# Altium project Carte_Mere.PrjPcb (part 1 of 3)
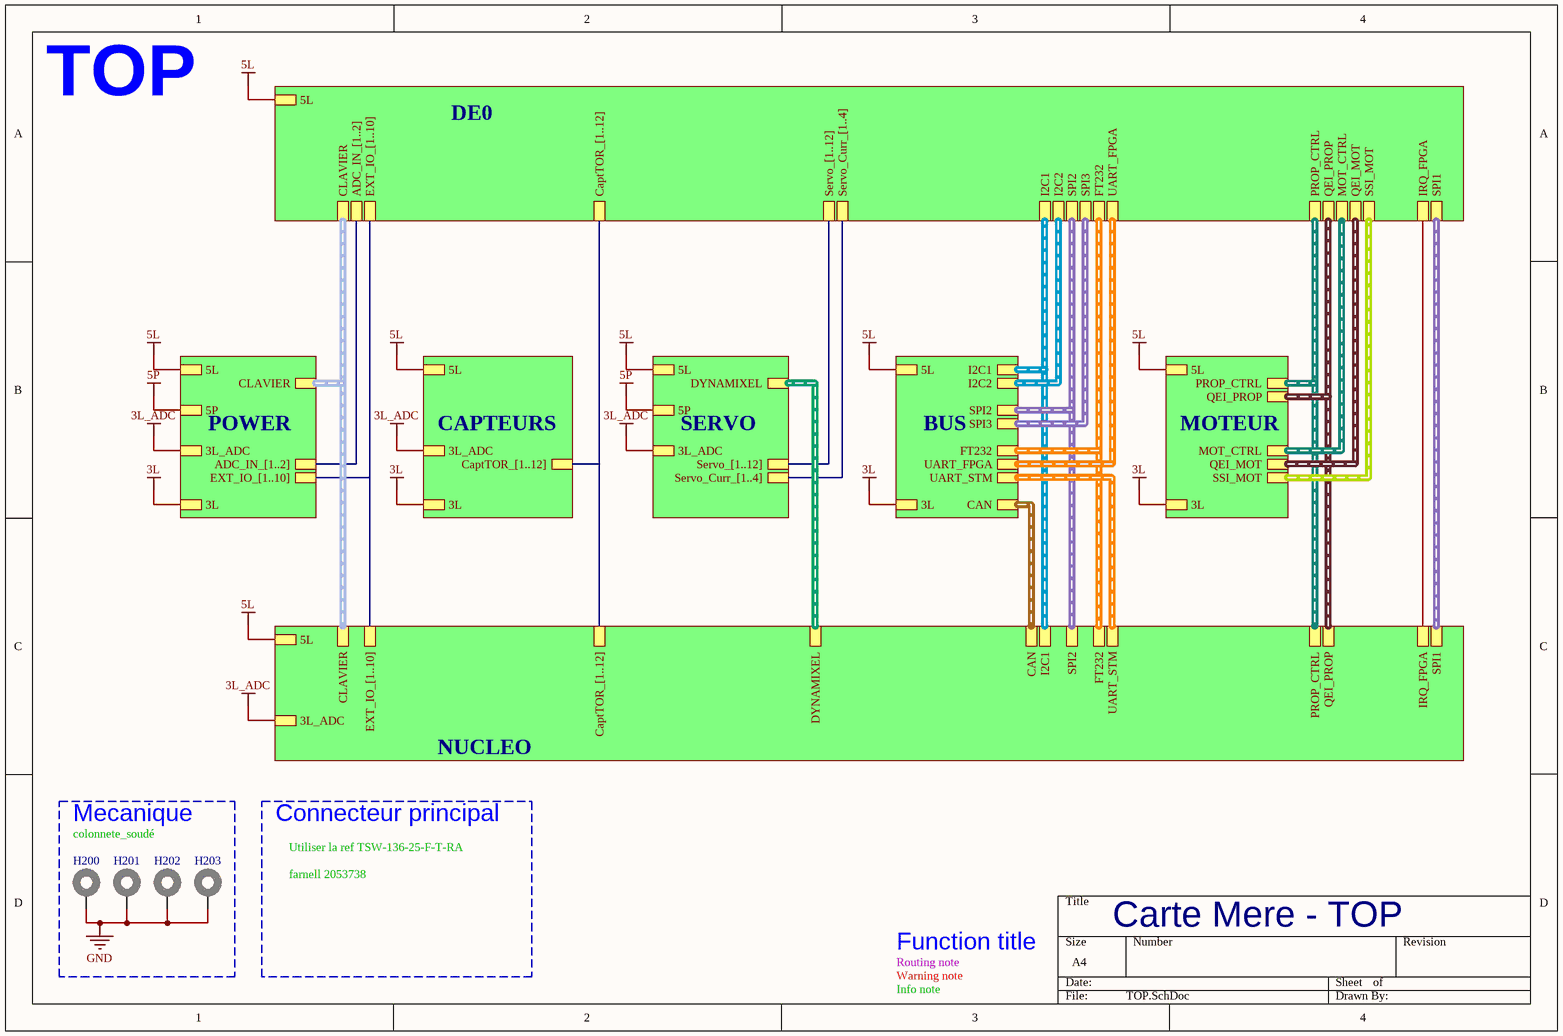
[diagram p0: TOP.SchDoc]
8 sheets, 396 parts. Net scope: hierarchical (ports join the sheet entries above them; power ports are global).
Board file: Carte_Mere.PcbDoc
Sheets:
  TOP.SchDoc
    DE0 = DE0_Nano.SchDoc
    NUCLEO = Nucleo.SchDoc
    CAPTEURS = Capteur.SchDoc
    BUS = Interface_BUS.SchDoc
    MOTEUR = Motorisation.SchDoc
    POWER = Power.SchDoc
    SERVO = Servomoteur.SchDoc

## Sheet TOP.SchDoc
size A4; Author: Audran; CompanyName: Goldorak; Address1: Electrolab; Address2: 52 rue Paul Lescop; Address3: 92000 Nanterre; DocumentNumber: 1; SheetNumber: 1; SheetTotal: 8; ProjectName: Cartes_2017

### Parts
H200  9774100960  [9774100960]  (value not drawn)
H201  9774100960  [9774100960]  (value not drawn)
H202  9774100960  [9774100960]  (value not drawn)
H203  9774100960  [9774100960]  (value not drawn)

### Sub-sheets
BUS = Interface_BUS.SchDoc: SPI2 (harness SPI2), SPI3 (harness SPI3), FT232 (harness FT232), I2C1 (harness I2C1), I2C2 (harness I2C2), 5L, UART_FPGA (harness UART_FPGA), UART_STM (harness UART_STM), CAN (harness CAN), 3L
CAPTEURS = Capteur.SchDoc: 3L_ADC, 5L, CaptTOR_[1..12], 3L
DE0 = DE0_Nano.SchDoc: FT232 (harness FT232), Servo_Curr_[1..4] (harness CLAVIER), UART_FPGA (harness UART_FPGA), CaptTOR_[1..12], SSI_MOT (harness SSI_MOT), I2C2 (harness I2C2), SPI1 (harness SPI1), IRQ_FPGA, CLAVIER (harness CLAVIER), I2C1 (harness I2C1), 5L, Servo_[1..12], SPI3 (harness SPI3), SPI2 (harness SPI2), QEI_MOT (harness QEI_MOT), MOT_CTRL (harness MOT_CTRL), QEI_PROP (harness QEI_PROP), PROP_CTRL (harness PROP_CTRL), ADC_IN_[1..2], EXT_IO_[1..10]
MOTEUR = Motorisation.SchDoc: QEI_PROP (harness QEI_PROP), QEI_MOT (harness QEI_MOT), MOT_CTRL (harness MOT_CTRL), 3L, PROP_CTRL (harness PROP_CTRL), SSI_MOT (harness SSI_MOT), 5L
NUCLEO = Nucleo.SchDoc: SPI1 (harness SPI1), UART_STM (harness UART_STM), I2C1 (harness I2C1), DYNAMIXEL (harness DYNAMIXEL), CaptTOR_[1..12], CAN (harness CAN), FT232 (harness FT232), SPI2 (harness SPI2), IRQ_FPGA, 3L_ADC, 5L, QEI_PROP (harness QEI_PROP), PROP_CTRL (harness PROP_CTRL), CLAVIER (harness CLAVIER), EXT_IO_[1..10]
POWER = Power.SchDoc: CLAVIER (harness CLAVIER), 3L, 3L_ADC, 5P, 5L, EXT_IO_[1..10], ADC_IN_[1..2]
SERVO = Servomoteur.SchDoc: 5L, DYNAMIXEL (harness DYNAMIXEL), 5P, 3L_ADC, Servo_[1..12], Servo_Curr_[1..4]

### Nets
3L: sheet CAPTEURS/3L, sheet BUS/3L, sheet MOTEUR/3L, sheet POWER/3L
3L_ADC: sheet NUCLEO/3L_ADC, sheet CAPTEURS/3L_ADC, sheet POWER/3L_ADC, sheet SERVO/3L_ADC
5L: sheet DE0/5L, sheet NUCLEO/5L, sheet CAPTEURS/5L, sheet BUS/5L, sheet MOTEUR/5L, sheet POWER/5L, sheet SERVO/5L
5P: sheet POWER/5P, sheet SERVO/5P
GND: H200.1 H201.1 H202.1 H203.1
IRQ_FPGA: sheet DE0/IRQ_FPGA, sheet NUCLEO/IRQ_FPGA

### Buses and harness runs
bus sheet CAPTEURS/CaptTOR_[1..12] = sheet DE0/CaptTOR_[1..12] = sheet NUCLEO/CaptTOR_[1..12]
bus sheet DE0/ADC_IN_[1..2] = sheet POWER/ADC_IN_[1..2]
bus sheet DE0/EXT_IO_[1..10] = sheet NUCLEO/EXT_IO_[1..10] = sheet POWER/EXT_IO_[1..10]
bus sheet DE0/Servo_[1..12] = sheet SERVO/Servo_[1..12]
harness sheet BUS/CAN = sheet NUCLEO/CAN
harness sheet BUS/FT232 = sheet DE0/FT232 = sheet NUCLEO/FT232
harness sheet BUS/I2C1 = sheet DE0/I2C1 = sheet NUCLEO/I2C1
harness sheet BUS/I2C2 = sheet DE0/I2C2
harness sheet BUS/SPI2 = sheet DE0/SPI2 = sheet NUCLEO/SPI2
harness sheet BUS/SPI3 = sheet DE0/SPI3
harness sheet BUS/UART_FPGA = sheet DE0/UART_FPGA
harness sheet BUS/UART_STM = sheet NUCLEO/UART_STM
harness sheet DE0/CLAVIER = sheet NUCLEO/CLAVIER = sheet POWER/CLAVIER
harness sheet DE0/MOT_CTRL = sheet MOTEUR/MOT_CTRL
harness sheet DE0/PROP_CTRL = sheet MOTEUR/PROP_CTRL = sheet NUCLEO/PROP_CTRL
harness sheet DE0/QEI_MOT = sheet MOTEUR/QEI_MOT
harness sheet DE0/QEI_PROP = sheet MOTEUR/QEI_PROP = sheet NUCLEO/QEI_PROP
harness sheet DE0/SPI1 = sheet NUCLEO/SPI1
harness sheet DE0/SSI_MOT = sheet MOTEUR/SSI_MOT
harness sheet NUCLEO/DYNAMIXEL = sheet SERVO/DYNAMIXEL

### Notes on the sheet
- TOP
- Mecanique
- colonnete_soudé
- Connecteur principal
- Utiliser la ref TSW-136-25-F-T-RA
- farnell 2053738
- Routing note
- Warning note
- Function title
- Carte Mere - TOP
- Info note

### Library data of the parts
H200-H203 = 9774100960: WA-SMST SMT Steel Spacer with through hole, OD6mm, ID3.3xL10mm; Manufacturer: Wurth Elektronik; Value: 3.3x10; ComponentLink1Description: Manufacturer; ComponentLink1URL: https://www.we-online.com/catalog/en/SMST_SMD_STEEL_SPACER_3_3_INTERNAL_NON_STOP/#9774100960; ComponentLink2Description: Datasheet; ComponentLink2URL: https://www.we-online.com/catalog/datasheet/9774100960.pdf; Manufacturer Part Number: 9774100960; Supplier 1: Farnell; Supplier Part Number 1: 2497637

## Sheet DE0_Nano.SchDoc
size A4; Author: Audran; CompanyName: Goldorak; Address1: Electrolab; Address2: 52 rue Paul Lescop; Address3: 92000 Nanterre; DocumentNumber: 3; SheetNumber: 3; SheetTotal: 8; ProjectName: Cartes_2017
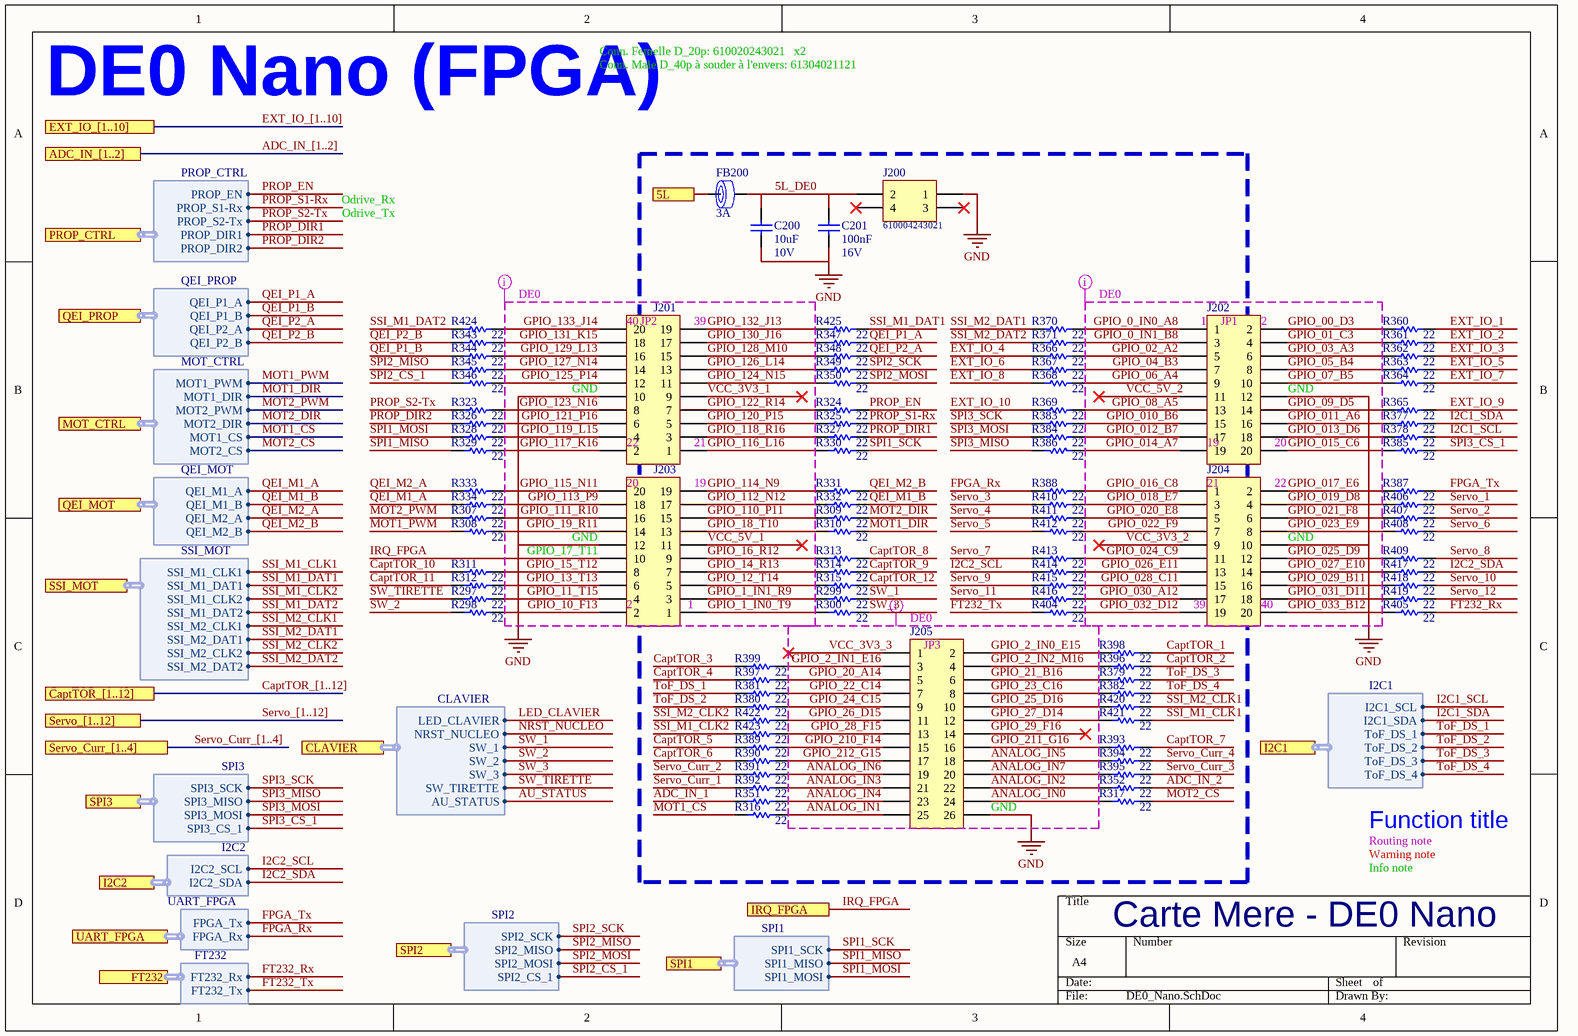
[diagram p1: DE0_Nano.SchDoc]

### Parts
C200  10uF  RatedVoltage: 10V  [WCAP-CSGP_0805, 2x1.25x1.25]
C201  100nF  RatedVoltage: 16V  [WCAP-CSGP_0402, 1x0.5x0.5]
FB200  RatedCurrent: 3A  [WE-CBF_0805_High Current]  (hidden comment: 742792023)
J200  610004243021  [610004243021_NO-HOLE]
J201  610020243021  [610020243021_NO-HOLE]  (value not drawn)
J202  610020243021  [610020243021_NO-HOLE]  (value not drawn)
J203  610020243021  [610020243021_NO-HOLE]  (value not drawn)
J204  610020243021  [610020243021_NO-HOLE]  (value not drawn)
J205  610026243021  [610026243021_NO-HOLE]  (value not drawn)
R297  value 22  [RESC1005X04N]  (hidden comment: RC0402FR-0722RL)
R298  value 22  [RESC1005X04N]  (hidden comment: RC0402FR-0722RL)
R299  value 22  [RESC1005X04N]  (hidden comment: RC0402FR-0722RL)
R300  value 22  [RESC1005X04N]  (hidden comment: RC0402FR-0722RL)
R307  value 22  [RESC1005X04N]  (hidden comment: RC0402FR-0722RL)
R308  value 22  [RESC1005X04N]  (hidden comment: RC0402FR-0722RL)
R309  value 22  [RESC1005X04N]  (hidden comment: RC0402FR-0722RL)
R310  value 22  [RESC1005X04N]  (hidden comment: RC0402FR-0722RL)
R311  value 22  [RESC1005X04N]  (hidden comment: RC0402FR-0722RL)
R312  value 22  [RESC1005X04N]  (hidden comment: RC0402FR-0722RL)
R313  value 22  [RESC1005X04N]  (hidden comment: RC0402FR-0722RL)
R314  value 22  [RESC1005X04N]  (hidden comment: RC0402FR-0722RL)
R315  value 22  [RESC1005X04N]  (hidden comment: RC0402FR-0722RL)
R316  value 22  [RESC1005X04N]  (hidden comment: RC0402FR-0722RL)
R317  value 22  [RESC1005X04N]  (hidden comment: RC0402FR-0722RL)
R323  value 22  [RESC1005X04N]  (hidden comment: RC0402FR-0722RL)
R324  value 22  [RESC1005X04N]  (hidden comment: RC0402FR-0722RL)
R325  value 22  [RESC1005X04N]  (hidden comment: RC0402FR-0722RL)
R326  value 22  [RESC1005X04N]  (hidden comment: RC0402FR-0722RL)
R327  value 22  [RESC1005X04N]  (hidden comment: RC0402FR-0722RL)
R328  value 22  [RESC1005X04N]  (hidden comment: RC0402FR-0722RL)
R329  value 22  [RESC1005X04N]  (hidden comment: RC0402FR-0722RL)
R330  value 22  [RESC1005X04N]  (hidden comment: RC0402FR-0722RL)
R331  value 22  [RESC1005X04N]  (hidden comment: RC0402FR-0722RL)
R332  value 22  [RESC1005X04N]  (hidden comment: RC0402FR-0722RL)
R333  value 22  [RESC1005X04N]  (hidden comment: RC0402FR-0722RL)
R334  value 22  [RESC1005X04N]  (hidden comment: RC0402FR-0722RL)
R343  value 22  [RESC1005X04N]  (hidden comment: RC0402FR-0722RL)
R344  value 22  [RESC1005X04N]  (hidden comment: RC0402FR-0722RL)
R345  value 22  [RESC1005X04N]  (hidden comment: RC0402FR-0722RL)
R346  value 22  [RESC1005X04N]  (hidden comment: RC0402FR-0722RL)
R347  value 22  [RESC1005X04N]  (hidden comment: RC0402FR-0722RL)
R348  value 22  [RESC1005X04N]  (hidden comment: RC0402FR-0722RL)
R349  value 22  [RESC1005X04N]  (hidden comment: RC0402FR-0722RL)
R350  value 22  [RESC1005X04N]  (hidden comment: RC0402FR-0722RL)
R351  value 22  [RESC1005X04N]  (hidden comment: RC0402FR-0722RL)
R352  value 22  [RESC1005X04N]  (hidden comment: RC0402FR-0722RL)
R360  value 22  [RESC1005X04N]  (hidden comment: RC0402FR-0722RL)
R361  value 22  [RESC1005X04N]  (hidden comment: RC0402FR-0722RL)
R362  value 22  [RESC1005X04N]  (hidden comment: RC0402FR-0722RL)
R363  value 22  [RESC1005X04N]  (hidden comment: RC0402FR-0722RL)
R364  value 22  [RESC1005X04N]  (hidden comment: RC0402FR-0722RL)
R365  value 22  [RESC1005X04N]  (hidden comment: RC0402FR-0722RL)
R366  value 22  [RESC1005X04N]  (hidden comment: RC0402FR-0722RL)
R367  value 22  [RESC1005X04N]  (hidden comment: RC0402FR-0722RL)
R368  value 22  [RESC1005X04N]  (hidden comment: RC0402FR-0722RL)
R369  value 22  [RESC1005X04N]  (hidden comment: RC0402FR-0722RL)
R370  value 22  [RESC1005X04N]  (hidden comment: RC0402FR-0722RL)
R371  value 22  [RESC1005X04N]  (hidden comment: RC0402FR-0722RL)
R377  value 22  [RESC1005X04N]  (hidden comment: RC0402FR-0722RL)
R378  value 22  [RESC1005X04N]  (hidden comment: RC0402FR-0722RL)
R379  value 22  [RESC1005X04N]  (hidden comment: RC0402FR-0722RL)
R380  value 22  [RESC1005X04N]  (hidden comment: RC0402FR-0722RL)
R381  value 22  [RESC1005X04N]  (hidden comment: RC0402FR-0722RL)
R382  value 22  [RESC1005X04N]  (hidden comment: RC0402FR-0722RL)
R383  value 22  [RESC1005X04N]  (hidden comment: RC0402FR-0722RL)
R384  value 22  [RESC1005X04N]  (hidden comment: RC0402FR-0722RL)
R385  value 22  [RESC1005X04N]  (hidden comment: RC0402FR-0722RL)
R386  value 22  [RESC1005X04N]  (hidden comment: RC0402FR-0722RL)
R387  value 22  [RESC1005X04N]  (hidden comment: RC0402FR-0722RL)
R388  value 22  [RESC1005X04N]  (hidden comment: RC0402FR-0722RL)
R389  value 22  [RESC1005X04N]  (hidden comment: RC0402FR-0722RL)
R390  value 22  [RESC1005X04N]  (hidden comment: RC0402FR-0722RL)
R391  value 22  [RESC1005X04N]  (hidden comment: RC0402FR-0722RL)
R392  value 22  [RESC1005X04N]  (hidden comment: RC0402FR-0722RL)
R393  value 22  [RESC1005X04N]  (hidden comment: RC0402FR-0722RL)
R394  value 22  [RESC1005X04N]  (hidden comment: RC0402FR-0722RL)
R395  value 22  [RESC1005X04N]  (hidden comment: RC0402FR-0722RL)
R396  value 22  [RESC1005X04N]  (hidden comment: RC0402FR-0722RL)
R397  value 22  [RESC1005X04N]  (hidden comment: RC0402FR-0722RL)
R398  value 22  [RESC1005X04N]  (hidden comment: RC0402FR-0722RL)
R399  value 22  [RESC1005X04N]  (hidden comment: RC0402FR-0722RL)
R404  value 22  [RESC1005X04N]  (hidden comment: RC0402FR-0722RL)
R405  value 22  [RESC1005X04N]  (hidden comment: RC0402FR-0722RL)
R406  value 22  [RESC1005X04N]  (hidden comment: RC0402FR-0722RL)
R407  value 22  [RESC1005X04N]  (hidden comment: RC0402FR-0722RL)
R408  value 22  [RESC1005X04N]  (hidden comment: RC0402FR-0722RL)
R409  value 22  [RESC1005X04N]  (hidden comment: RC0402FR-0722RL)
R410  value 22  [RESC1005X04N]  (hidden comment: RC0402FR-0722RL)
R411  value 22  [RESC1005X04N]  (hidden comment: RC0402FR-0722RL)
R412  value 22  [RESC1005X04N]  (hidden comment: RC0402FR-0722RL)
R413  value 22  [RESC1005X04N]  (hidden comment: RC0402FR-0722RL)
R414  value 22  [RESC1005X04N]  (hidden comment: RC0402FR-0722RL)
R415  value 22  [RESC1005X04N]  (hidden comment: RC0402FR-0722RL)
R416  value 22  [RESC1005X04N]  (hidden comment: RC0402FR-0722RL)
R417  value 22  [RESC1005X04N]  (hidden comment: RC0402FR-0722RL)
R418  value 22  [RESC1005X04N]  (hidden comment: RC0402FR-0722RL)
R419  value 22  [RESC1005X04N]  (hidden comment: RC0402FR-0722RL)
R420  value 22  [RESC1005X04N]  (hidden comment: RC0402FR-0722RL)
R421  value 22  [RESC1005X04N]  (hidden comment: RC0402FR-0722RL)
R422  value 22  [RESC1005X04N]  (hidden comment: RC0402FR-0722RL)
R423  value 22  [RESC1005X04N]  (hidden comment: RC0402FR-0722RL)
R424  value 22  [RESC1005X04N]  (hidden comment: RC0402FR-0722RL)
R425  value 22  [RESC1005X04N]  (hidden comment: RC0402FR-0722RL)

### Ports
5L, ADC_IN_[1..2], CaptTOR_[1..12], CLAVIER (harness CLAVIER), EXT_IO_[1..10], FT232 (harness FT232), I2C1 (harness I2C1), I2C2 (harness I2C2), IRQ_FPGA, MOT_CTRL (harness MOT_CTRL), PROP_CTRL (harness PROP_CTRL), QEI_MOT (harness QEI_MOT), QEI_PROP (harness QEI_PROP), Servo_[1..12], Servo_Curr_[1..4] (harness CLAVIER), SPI1 (harness SPI1), SPI2 (harness SPI2), SPI3 (harness SPI3), SSI_MOT (harness SSI_MOT), UART_FPGA (harness UART_FPGA)

### Harnesses
PROP_CTRL: PROP_EN, PROP_S1-Rx, PROP_S2-Tx, PROP_DIR1, PROP_DIR2
QEI_PROP: QEI_P1_A, QEI_P1_B, QEI_P2_A, QEI_P2_B
MOT_CTRL: MOT1_PWM, MOT1_DIR, MOT2_PWM, MOT2_DIR, MOT1_CS, MOT2_CS
QEI_MOT: QEI_M1_A, QEI_M1_B, QEI_M2_A, QEI_M2_B
SSI_MOT: SSI_M1_CLK1, SSI_M1_DAT1, SSI_M1_CLK2, SSI_M1_DAT2, SSI_M2_CLK1, SSI_M2_DAT1, SSI_M2_CLK2, SSI_M2_DAT2
SPI3: SPI3_SCK, SPI3_MISO, SPI3_MOSI, SPI3_CS_1
I2C2: I2C2_SCL, I2C2_SDA
UART_FPGA: FPGA_Tx, FPGA_Rx
FT232: FT232_Tx, FT232_Rx
SPI2: SPI2_SCK, SPI2_MISO, SPI2_MOSI, SPI2_CS_1
SPI1: SPI1_SCK, SPI1_MISO, SPI1_MOSI
I2C1: I2C1_SCL, I2C1_SDA, ToF_DS_1, ToF_DS_2, ToF_DS_3, ToF_DS_4
CLAVIER: LED_CLAVIER, NRST_NUCLEO, SW_1, SW_2, SW_3, SW_TIRETTE, AU_STATUS

### Nets
5L: FB200.1 ; port 5L
GND: C200.2 C201.2 J200.1 J201.10 J202.12 J203.12 J204.10 J205.26
5L_DE0: C200.1 C201.1 FB200.2 J200.2
ADC_IN_1: R351.1
ADC_IN_2: R352.2
ANALOG_IN0: J205.24 R317.1
ANALOG_IN1: J205.25 R316.2
ANALOG_IN2: J205.22 R352.1
ANALOG_IN3: J205.21 R392.2
ANALOG_IN4: J205.23 R351.2
ANALOG_IN5: J205.18 R394.1
ANALOG_IN6: J205.19 R391.2
ANALOG_IN7: J205.20 R395.1
CaptTOR_1: R398.2
CaptTOR_2: R396.1
CaptTOR_3: R399.2
CaptTOR_4: R397.1
CaptTOR_5: R389.1
CaptTOR_6: R390.1
CaptTOR_7: R393.2
CaptTOR_8: R313.2
CaptTOR_9: R314.2
CaptTOR_10: R311.1
CaptTOR_11: R312.1
CaptTOR_12: R315.2
EXT_IO_1: R360.2
EXT_IO_2: R361.2
EXT_IO_3: R362.2
EXT_IO_4: R366.1
EXT_IO_5: R363.2
EXT_IO_6: R367.1
EXT_IO_7: R364.2
EXT_IO_8: R368.1
EXT_IO_9: R365.2
EXT_IO_10: R369.1
FPGA_Rx: R388.1 ; port UART_FPGA.FPGA_Rx
FPGA_Tx: R387.2 ; port UART_FPGA.FPGA_Tx
FT232_Rx: R405.2 ; port FT232.FT232_Rx
FT232_Tx: R404.1 ; port FT232.FT232_Tx
GPIO_00_D3: J202.2 R360.1
GPIO_0_IN0_A8: J202.1 R370.2
GPIO_0_IN1_B8: J202.3 R371.2
GPIO_01_C3: J202.4 R361.1
GPIO_1_IN0_T9: J203.1 R300.1
GPIO_1_IN1_R9: J203.3 R299.1
GPIO_02_A2: J202.5 R366.2
GPIO_2_IN0_E15: J205.2 R398.1
GPIO_2_IN1_E16: J205.3 R399.1
GPIO_2_IN2_M16: J205.4 R396.2
GPIO_03_A3: J202.6 R362.1
GPIO_04_B3: J202.7 R367.2
GPIO_05_B4: J202.8 R363.1
GPIO_06_A4: J202.9 R368.2
GPIO_07_B5: J202.10 R364.1
GPIO_08_A5: J202.13 R369.2
GPIO_09_D5: J202.14 R365.1
GPIO_010_B6: J202.15 R383.2
GPIO_10_F13: J203.2 R298.2
GPIO_011_A6: J202.16 R377.1
GPIO_11_T15: J203.4 R297.2
GPIO_012_B7: J202.17 R384.2
GPIO_12_T14: J203.5 R315.1
GPIO_013_D6: J202.18 R378.1
GPIO_13_T13: J203.6 R312.2
GPIO_014_A7: J202.19 R386.1
GPIO_14_R13: J203.7 R314.1
GPIO_015_C6: J202.20 R385.1
GPIO_15_T12: J203.8 R311.2
GPIO_016_C8: J204.1 R388.2
GPIO_16_R12: J203.9 R313.1
GPIO_017_E6: J204.2 R387.1
GPIO_018_E7: J204.3 R410.2
GPIO_18_T10: J203.13 R310.1
GPIO_019_D8: J204.4 R406.1
GPIO_19_R11: J203.14 R308.2
GPIO_20_A14: J205.5 R397.2
GPIO_020_E8: J204.5 R411.2
GPIO_21_B16: J205.6 R379.1
GPIO_021_F8: J204.6 R407.1
GPIO_22_C14: J205.7 R381.2
GPIO_022_F9: J204.7 R412.2
GPIO_23_C16: J205.8 R382.2
GPIO_023_E9: J204.8 R408.1
GPIO_024_C9: J204.11 R413.2
GPIO_24_C15: J205.9 R380.2
GPIO_025_D9: J204.12 R409.1
GPIO_25_D16: J205.10 R420.1
GPIO_26_D15: J205.11 R422.2
GPIO_026_E11: J204.13 R414.2
GPIO_27_D14: J205.12 R421.1
GPIO_027_E10: J204.14 R417.1
GPIO_028_C11: J204.15 R415.2
GPIO_28_F15: J205.13 R423.2
GPIO_029_B11: J204.16 R418.1
GPIO_29_F16: J205.14
GPIO_030_A12: J204.17 R416.2
GPIO_031_D11: J204.18 R419.1
GPIO_032_D12: J204.19 R404.2
GPIO_033_B12: J204.20 R405.1
GPIO_110_P11: J203.15 R309.1
GPIO_111_R10: J203.16 R307.2
GPIO_112_N12: J203.17 R332.1
GPIO_113_P9: J203.18 R334.2
GPIO_114_N9: J203.19 R331.1
GPIO_115_N11: J203.20 R333.2
GPIO_116_L16: J201.1 R330.1
GPIO_117_K16: J201.2 R329.2
GPIO_118_R16: J201.3 R327.1
GPIO_119_L15: J201.4 R328.2
GPIO_120_P15: J201.5 R325.1
GPIO_121_P16: J201.6 R326.2
GPIO_122_R14: J201.7 R324.1
GPIO_123_N16: J201.8 R323.2
GPIO_124_N15: J201.11 R350.1
GPIO_125_P14: J201.12 R346.2
GPIO_126_L14: J201.13 R349.1
GPIO_127_N14: J201.14 R345.2
GPIO_128_M10: J201.15 R348.1
GPIO_129_L13: J201.16 R344.2
GPIO_130_J16: J201.17 R347.1
GPIO_131_K15: J201.18 R343.2
GPIO_132_J13: J201.19 R425.1
GPIO_133_J14: J201.20 R424.2
GPIO_210_F14: J205.15 R389.2
GPIO_211_G16: J205.16 R393.1
GPIO_212_G15: J205.17 R390.2
I2C1_SCL: R378.2 ; port I2C1.I2C1_SCL
I2C1_SDA: R377.2 ; port I2C1.I2C1_SDA
I2C2_SCL: R414.1 ; port I2C2.I2C2_SCL
I2C2_SDA: R417.2 ; port I2C2.I2C2_SDA
IRQ_FPGA: J203.10 ; port IRQ_FPGA
MOT1_CS: R316.1 ; port MOT_CTRL.MOT1_CS
MOT1_DIR: R310.2 ; port MOT_CTRL.MOT1_DIR
MOT1_PWM: R308.1 ; port MOT_CTRL.MOT1_PWM
MOT2_CS: R317.2 ; port MOT_CTRL.MOT2_CS
MOT2_DIR: R309.2 ; port MOT_CTRL.MOT2_DIR
MOT2_PWM: R307.1 ; port MOT_CTRL.MOT2_PWM
PROP_DIR1: R327.2 ; port PROP_CTRL.PROP_DIR1
PROP_DIR2: R326.1 ; port PROP_CTRL.PROP_DIR2
PROP_EN: R324.2 ; port PROP_CTRL.PROP_EN
PROP_S1-Rx: R325.2 ; port PROP_CTRL.PROP_S1-Rx
PROP_S2-Tx: R323.1 ; port PROP_CTRL.PROP_S2-Tx
QEI_M1_A: R334.1 ; port QEI_MOT.QEI_M1_A
QEI_M1_B: R332.2 ; port QEI_MOT.QEI_M1_B
QEI_M2_A: R333.1 ; port QEI_MOT.QEI_M2_A
QEI_M2_B: R331.2 ; port QEI_MOT.QEI_M2_B
QEI_P1_A: R347.2 ; port QEI_PROP.QEI_P1_A
QEI_P1_B: R344.1 ; port QEI_PROP.QEI_P1_B
QEI_P2_A: R348.2 ; port QEI_PROP.QEI_P2_A
QEI_P2_B: R343.1 ; port QEI_PROP.QEI_P2_B
Servo_1: R406.2
Servo_2: R407.2
Servo_3: R410.1
Servo_4: R411.1
Servo_5: R412.1
Servo_6: R408.2
Servo_7: R413.1
Servo_8: R409.2
Servo_9: R415.1
Servo_10: R418.2
Servo_11: R416.1
Servo_12: R419.2
Servo_Curr_1: R392.1
Servo_Curr_2: R391.1
Servo_Curr_3: R395.2
Servo_Curr_4: R394.2
SPI1_MISO: R329.1 ; port SPI1.SPI1_MISO
SPI1_MOSI: R328.1 ; port SPI1.SPI1_MOSI
SPI1_SCK: R330.2 ; port SPI1.SPI1_SCK
SPI2_CS_1: R346.1 ; port SPI2.SPI2_CS_1
SPI2_MISO: R345.1 ; port SPI2.SPI2_MISO
SPI2_MOSI: R350.2 ; port SPI2.SPI2_MOSI
SPI2_SCK: R349.2 ; port SPI2.SPI2_SCK
SPI3_CS_1: R385.2 ; port SPI3.SPI3_CS_1
SPI3_MISO: R386.2 ; port SPI3.SPI3_MISO
SPI3_MOSI: R384.1 ; port SPI3.SPI3_MOSI
SPI3_SCK: R383.1 ; port SPI3.SPI3_SCK
SSI_M1_CLK1: R421.2 ; port SSI_MOT.SSI_M1_CLK1
SSI_M1_CLK2: R423.1 ; port SSI_MOT.SSI_M1_CLK2
SSI_M1_DAT1: R425.2 ; port SSI_MOT.SSI_M1_DAT1
SSI_M1_DAT2: R424.1 ; port SSI_MOT.SSI_M1_DAT2
SSI_M2_CLK1: R420.2 ; port SSI_MOT.SSI_M2_CLK1
SSI_M2_CLK2: R422.1 ; port SSI_MOT.SSI_M2_CLK2
SSI_M2_DAT1: R370.1 ; port SSI_MOT.SSI_M2_DAT1
SSI_M2_DAT2: R371.1 ; port SSI_MOT.SSI_M2_DAT2
SW_1: R299.2 ; port CLAVIER.SW_1
SW_2: R298.1 ; port CLAVIER.SW_2
SW_3: R300.2 ; port CLAVIER.SW_3
SW_TIRETTE: R297.1 ; port CLAVIER.SW_TIRETTE
ToF_DS_1: R381.1 ; port I2C1.ToF_DS_1
ToF_DS_2: R380.1 ; port I2C1.ToF_DS_2
ToF_DS_3: R379.2 ; port I2C1.ToF_DS_3
ToF_DS_4: R382.1 ; port I2C1.ToF_DS_4
VCC_3V3_1: J201.9
VCC_3V3_2: J204.9
VCC_3V3_3: J205.1
VCC_5V_1: J203.11
VCC_5V_2: J202.11

Not connected (* = marked no-connect by the designer): J200 3* 4*

### Buses and harness runs
bus ADC_IN_[1..2] = port ADC_IN_[1..2]
bus CaptTOR_[1..12] = port CaptTOR_[1..12]
bus EXT_IO_[1..10] = port EXT_IO_[1..10]
bus Servo_[1..12] = port Servo_[1..12]
bus Servo_Curr_[1..4]

### Layout directives
net class DE0: ANALOG_IN0, ANALOG_IN1, ANALOG_IN2, ANALOG_IN3, ANALOG_IN4, ANALOG_IN5, ANALOG_IN6, ANALOG_IN7, GND, GPIO_00_D3, GPIO_0_IN0_A8, GPIO_0_IN1_B8, GPIO_01_C3, GPIO_1_IN0_T9, GPIO_1_IN1_R9, GPIO_02_A2, GPIO_2_IN0_E15, GPIO_2_IN1_E16, GPIO_2_IN2_M16, GPIO_03_A3, GPIO_04_B3, GPIO_05_B4, GPIO_06_A4, GPIO_07_B5, GPIO_08_A5, GPIO_09_D5, GPIO_010_B6, GPIO_10_F13, GPIO_011_A6, GPIO_11_T15, GPIO_012_B7, GPIO_12_T14, GPIO_013_D6, GPIO_13_T13, GPIO_014_A7, GPIO_14_R13, GPIO_015_C6, GPIO_15_T12, GPIO_016_C8, GPIO_16_R12, GPIO_017_E6, GPIO_018_E7, GPIO_18_T10, GPIO_019_D8, GPIO_19_R11, GPIO_20_A14, GPIO_020_E8, GPIO_21_B16, GPIO_021_F8, GPIO_22_C14, GPIO_022_F9, GPIO_23_C16, GPIO_023_E9, GPIO_024_C9, GPIO_24_C15, GPIO_025_D9, GPIO_25_D16, GPIO_26_D15, GPIO_026_E11, GPIO_27_D14, GPIO_027_E10, GPIO_028_C11, GPIO_28_F15, GPIO_029_B11, GPIO_29_F16, GPIO_030_A12, GPIO_031_D11, GPIO_032_D12, GPIO_033_B12, GPIO_110_P11, GPIO_111_R10, GPIO_112_N12, GPIO_113_P9, GPIO_114_N9, GPIO_115_N11, GPIO_116_L16, GPIO_117_K16, GPIO_118_R16, GPIO_119_L15, GPIO_120_P15, GPIO_121_P16, GPIO_122_R14, GPIO_123_N16, GPIO_124_N15, GPIO_125_P14, GPIO_126_L14, GPIO_127_N14, GPIO_128_M10, GPIO_129_L13, GPIO_130_J16, GPIO_131_K15, GPIO_132_J13, GPIO_133_J14, GPIO_210_F14, GPIO_211_G16, GPIO_212_G15, VCC_3V3_1, VCC_3V3_2, VCC_3V3_3, VCC_5V_1, VCC_5V_2

### Notes on the sheet
- DE0 Nano (FPGA)
- Conn. Male D_40p à souder à l'envers: 61304021121
- Conn. Femelle D_20p: 610020243021   x2
- Odrive_Tx
- Odrive_Rx
- (near J201) 40
- (near J201) JP2
- (near J201) 39
- (near J202) 1
- (near J202) JP1
- (near J202) 2
- (near J201) GND
- (near J201) 22
- (near J201) 21
- (near J202) 19
- (near J202) 20
- (near J202) GND
- (near J203) 20
- (near J203) 19
- (near J204) 21
- (near J204) 22
- (near J203) GND
- GPIO_17_T11
- (near J204) GND
- (near J203) 2
- (near J203) 1
- (near J205) JP3
- (near J204) 39
- (near J204) 40
- (near J205) GND
- Routing note
- Function title
- Warning note
- Info note
- Carte Mere - DE0 Nano

### Library data of the parts
C200 = WCAP-CSGP, 885012207026: CAP CER 10uF 10V X7R 0805; Manufacturer: Wurth Elektronik; ComponentLink1Description: Datasheet; ComponentLink1URL: http://katalog.we-online.com/pbs/datasheet/885012207026.pdf; Manufacturer Part Number: 885012207026; Value: 10uF; Size: 0805; CeramicType: X7R; Supplier 1: Farnell; Supplier Part Number 1: 2495189; Supplier Part Number 2: C15850; Supplier 2: JLCPCB; Supplier Footprint 2: 0805
C201 = WCAP-CSGP, 885012205037: CAP CER 100nF 16V X7R 0402; Manufacturer: Wurth Elektronik; ComponentLink1Description: Datasheet; ComponentLink1URL: http://katalog.we-online.com/pbs/datasheet/885012205037.pdf; Manufacturer Part Number: 885012205037; Value: 100nF; Size: 0402; CeramicType: X7R; Supplier 2: JLCPCB; Supplier Part Number 2: C1525; Supplier Footprint 2: 0402
FB200 = WE-CBF, 742792023: Ferrite Bead 120ohm 0805 3A; Manufacturer: Wurth Elektronik; Value: 120; ComponentLink1Description: Manufacturer; ComponentLink1URL: https://www.we-online.com/catalog/en/WE-CBF/?sq=742792023#742792023; ComponentLink2Description: Datasheet; ComponentLink2URL: https://www.we-online.com/catalog/datasheet/742792023.pdf; Manufacturer Part Number: 742792023; Supplier 2: JLCPCB; Supplier Part Number 2: C1015; Supplier 1: Farnell; Supplier Part Number 1: 1635732; Supplier Footprint 2: 0805
J200 = 610004243021: WR-PHD Socket Header, SMT, pitch 2.54mm, Dual Row, Vertical, 4p; Manufacturer: Wurth Elektronik; Value: 4; ComponentLink1Description: Datasheet; ComponentLink1URL: https://www.we-online.com/catalog/datasheet/610004243021.pdf; Manufacturer Part Number: 610004243021; Supplier 1: Farnell; Supplier Part Number 1: 2827931
J201-J204 = 610020243021: WR-PHD Socket Header, SMT, pitch 2.54mm, Dual Row, Vertical, 20p; Manufacturer: Wurth Elektronik; Value: 20; ComponentLink1Description: Datasheet; ComponentLink1URL: https://www.we-online.com/catalog/datasheet/610020243021.pdf; Manufacturer Part Number: 610020243021; Supplier 1: Farnell; Supplier Part Number 1: 2827937
J205 = 610026243021: WR-PHD Socket Header, SMT, pitch 2.54mm, Dual Row, Vertical, 26p; Manufacturer: Wurth Elektronik; Value: 26; ComponentLink1Description: Datasheet; ComponentLink1URL: https://www.we-online.com/catalog/datasheet/610026243021.pdf; Manufacturer Part Number: 610026243021; Supplier 1: Farnell; Supplier Part Number 1: 2827940
R297-R300 R307-R317 R323-R334 R343-R352 R360-R371 R377-R399 R404-R425 = RC0402FR-0722RL: RES SMD 22 OHM 1% 1/16W 0402; Manufacturer: Yageo; Power: 63mW; Vmax: 50V; Type: Thick Film; ComponentLink1Description: Manufacturer; ComponentLink1URL: http://www.yageo.com/NewPortal/_en/index.jsp; ComponentLink2Description: Datasheet; ComponentLink2URL: http://www.farnell.com/datasheets/2167052.pdf; Manufacturer Part Number: RC0402FR-0722RL; Supplier 1: Farnell; Supplier Part Number 1: 9239030; Precision: ±1%; Supplier 2: JLCPCB; Supplier Part Number 2: C25092; Supplier Footprint 2: 0402

## Sheet Nucleo.SchDoc
size A4; Author: Audran; CompanyName: Goldorak; Address1: Electrolab; Address2: 52 rue Paul Lescop; Address3: 92000 Nanterre; DocumentNumber: 2; SheetNumber: 2; SheetTotal: 8; ProjectName: Cartes_2017
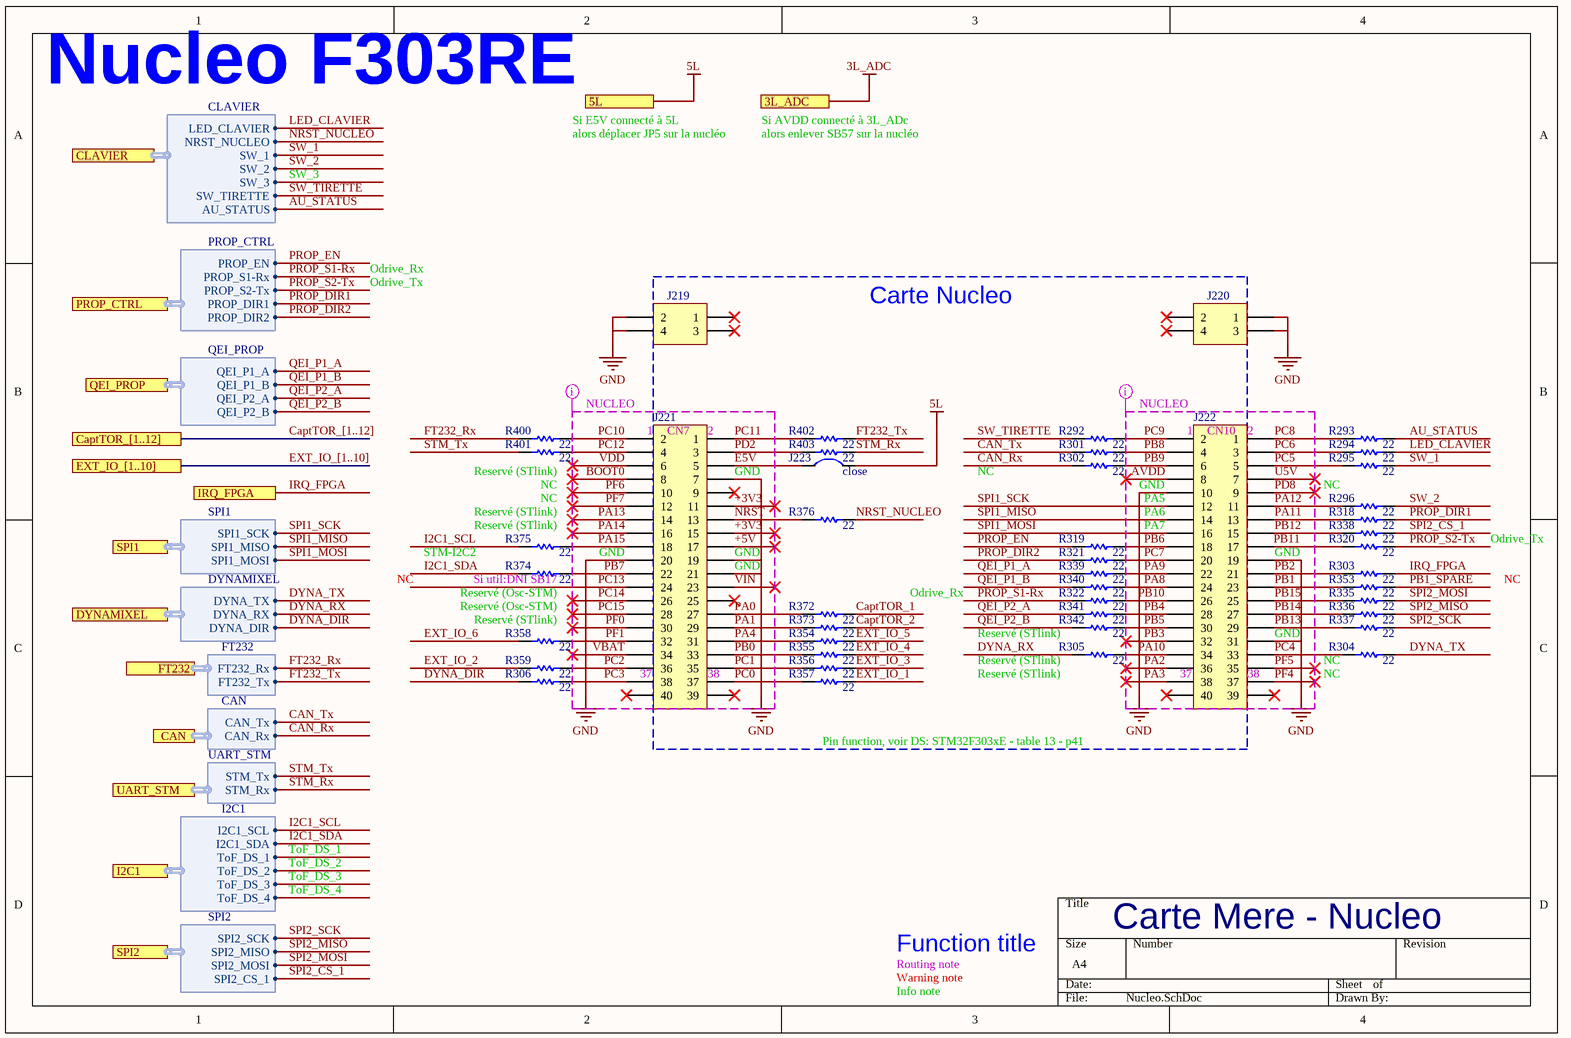
[diagram p2: Nucleo.SchDoc]

### Parts
J219  61000421821  [61000421821]  (value not drawn)
J220  61000421821  [61000421821]  (value not drawn)
J221  61004021821  [61004021821]  (value not drawn)
J222  61004021821  [61004021821]  (value not drawn)
J223  close  [CAVALIER_0603_C]  (net tie, no BOM)
R292  value 22  [RESC1005X04N]  (hidden comment: RC0402FR-0722RL)
R293  value 22  [RESC1005X04N]  (hidden comment: RC0402FR-0722RL)
R294  value 22  [RESC1005X04N]  (hidden comment: RC0402FR-0722RL)
R295  value 22  [RESC1005X04N]  (hidden comment: RC0402FR-0722RL)
R296  value 22  [RESC1005X04N]  (hidden comment: RC0402FR-0722RL)
R301  value 22  [RESC1005X04N]  (hidden comment: RC0402FR-0722RL)
R302  value 22  [RESC1005X04N]  (hidden comment: RC0402FR-0722RL)
R303  value 22  [RESC1005X04N]  (hidden comment: RC0402FR-0722RL)
R304  value 22  [RESC1005X04N]  (hidden comment: RC0402FR-0722RL)
R305  value 22  [RESC1005X04N]  (hidden comment: RC0402FR-0722RL)
R306  value 22  [RESC1005X04N]  (hidden comment: RC0402FR-0722RL)
R318  value 22  [RESC1005X04N]  (hidden comment: RC0402FR-0722RL)
R319  value 22  [RESC1005X04N]  (hidden comment: RC0402FR-0722RL)
R320  value 22  [RESC1005X04N]  (hidden comment: RC0402FR-0722RL)
R321  value 22  [RESC1005X04N]  (hidden comment: RC0402FR-0722RL)
R322  value 22  [RESC1005X04N]  (hidden comment: RC0402FR-0722RL)
R335  value 22  [RESC1005X04N]  (hidden comment: RC0402FR-0722RL)
R336  value 22  [RESC1005X04N]  (hidden comment: RC0402FR-0722RL)
R337  value 22  [RESC1005X04N]  (hidden comment: RC0402FR-0722RL)
R338  value 22  [RESC1005X04N]  (hidden comment: RC0402FR-0722RL)
R339  value 22  [RESC1005X04N]  (hidden comment: RC0402FR-0722RL)
R340  value 22  [RESC1005X04N]  (hidden comment: RC0402FR-0722RL)
R341  value 22  [RESC1005X04N]  (hidden comment: RC0402FR-0722RL)
R342  value 22  [RESC1005X04N]  (hidden comment: RC0402FR-0722RL)
R353  value 22  [RESC1005X04N]  (hidden comment: RC0402FR-0722RL)
R354  value 22  [RESC1005X04N]  (hidden comment: RC0402FR-0722RL)
R355  value 22  [RESC1005X04N]  (hidden comment: RC0402FR-0722RL)
R356  value 22  [RESC1005X04N]  (hidden comment: RC0402FR-0722RL)
R357  value 22  [RESC1005X04N]  (hidden comment: RC0402FR-0722RL)
R358  value 22  [RESC1005X04N]  (hidden comment: RC0402FR-0722RL)
R359  value 22  [RESC1005X04N]  (hidden comment: RC0402FR-0722RL)
R372  value 22  [RESC1005X04N]  (hidden comment: RC0402FR-0722RL)
R373  value 22  [RESC1005X04N]  (hidden comment: RC0402FR-0722RL)
R374  value 22  [RESC1005X04N]  (hidden comment: RC0402FR-0722RL)
R375  value 22  [RESC1005X04N]  (hidden comment: RC0402FR-0722RL)
R376  value 22  [RESC1005X04N]  (hidden comment: RC0402FR-0722RL)
R400  value 22  [RESC1005X04N]  (hidden comment: RC0402FR-0722RL)
R401  value 22  [RESC1005X04N]  (hidden comment: RC0402FR-0722RL)
R402  value 22  [RESC1005X04N]  (hidden comment: RC0402FR-0722RL)
R403  value 22  [RESC1005X04N]  (hidden comment: RC0402FR-0722RL)

### Blocks framed on the sheet
Carte Nucleo: J219-J223 R292 R301 R302 R305 R319 R321 R322 R339-R342 R354-R357 R372 R373 R376 R402 R403

### Ports
3L_ADC, 5L, CAN (harness CAN), CaptTOR_[1..12], CLAVIER (harness CLAVIER), DYNAMIXEL (harness DYNAMIXEL), EXT_IO_[1..10], FT232 (harness FT232), I2C1 (harness I2C1), IRQ_FPGA, PROP_CTRL (harness PROP_CTRL), QEI_PROP (harness QEI_PROP), SPI1 (harness SPI1), SPI2 (harness SPI2), UART_STM (harness UART_STM)

### Harnesses
CLAVIER: LED_CLAVIER, NRST_NUCLEO, SW_1, SW_2, SW_3, SW_TIRETTE, AU_STATUS
PROP_CTRL: PROP_EN, PROP_S1-Rx, PROP_S2-Tx, PROP_DIR1, PROP_DIR2
QEI_PROP: QEI_P1_A, QEI_P1_B, QEI_P2_A, QEI_P2_B
DYNAMIXEL: DYNA_TX, DYNA_RX, DYNA_DIR
FT232: FT232_Tx, FT232_Rx
UART_STM: STM_Tx, STM_Rx
SPI2: SPI2_SCK, SPI2_MISO, SPI2_MOSI, SPI2_CS_1
CAN: CAN_Rx, CAN_Tx
I2C1: I2C1_SCL, I2C1_SDA, ToF_DS_1, ToF_DS_2, ToF_DS_3, ToF_DS_4
SPI1: SPI1_SCK, SPI1_MISO, SPI1_MOSI

### Nets
5L: J223.2 ; port 5L
GND: J219.2 J219.4 J220.1 J220.3 J221.7 J221.19 J221.20 J221.21 J222.10 J222.19 J222.31
+3V3: J221.11 J221.15
+5V: J221.17
AU_STATUS: R293.2 ; port CLAVIER.AU_STATUS
AVDD: J222.8
BOOT0: J221.8
CAN_Rx: R302.1 ; port CAN.CAN_Rx
CAN_Tx: R301.1 ; port CAN.CAN_Tx
CaptTOR_1: R372.2
CaptTOR_2: R373.2
DYNA_DIR: R306.1 ; port DYNAMIXEL.DYNA_DIR
DYNA_RX: R305.1 ; port DYNAMIXEL.DYNA_RX
DYNA_TX: R304.2 ; port DYNAMIXEL.DYNA_TX
E5V: J221.5 J223.1
EXT_IO_1: R357.2
EXT_IO_2: R359.1
EXT_IO_3: R356.2
EXT_IO_4: R355.2
EXT_IO_5: R354.2
EXT_IO_6: R358.1
FT232_Rx: R400.1 ; port FT232.FT232_Rx
FT232_Tx: R402.2 ; port FT232.FT232_Tx
I2C1_SCL: R375.1 ; port I2C1.I2C1_SCL
I2C1_SDA: R374.1 ; port I2C1.I2C1_SDA
IRQ_FPGA: R303.2 ; port IRQ_FPGA
LED_CLAVIER: R294.2 ; port CLAVIER.LED_CLAVIER
NRST: J221.13 R376.1
NRST_NUCLEO: R376.2 ; port CLAVIER.NRST_NUCLEO
PA0: J221.27 R372.1
PA1: J221.29 R373.1
PA2: J222.36
PA3: J222.38
PA4: J221.31 R354.1
PA8: J222.24 R340.2
PA9: J222.22 R339.2
PA10: J222.34 R305.2
PA11: J222.13 R318.1
PA12: J222.11 R296.1
PA13: J221.14
PA14: J221.16
PA15: J221.18 R375.2
PB0: J221.33 R355.1
PB1: J222.23 R353.1
PB1_SPARE: R353.2
PB2: J222.21 R303.1
PB3: J222.32
PB4: J222.28 R341.2
PB5: J222.30 R342.2
PB6: J222.18 R319.2
PB7: J221.22 R374.2
PB8: J222.4 R301.2
PB9: J222.6 R302.2
PB10: J222.26 R322.2
PB11: J222.17 R320.1
PB12: J222.15 R338.1
PB13: J222.29 R337.1
PB14: J222.27 R336.1
PB15: J222.25 R335.1
PC0: J221.37 R357.1
PC1: J221.35 R356.1
PC2: J221.36 R359.2
PC3: J221.38 R306.2
PC4: J222.33 R304.1
PC5: J222.5 R295.1
PC6: J222.3 R294.1
PC7: J222.20 R321.2
PC8: J222.1 R293.1
PC9: J222.2 R292.2
PC10: J221.2 R400.2
PC11: J221.1 R402.1
PC12: J221.4 R401.2
PC13: J221.24
PC14: J221.26
PC15: J221.28
PD2: J221.3 R403.1
PD8: J222.9
PF0: J221.30
PF1: J221.32 R358.2
PF4: J222.37
PF5: J222.35
PF6: J221.10
PF7: J221.12
PROP_DIR1: R318.2 ; port PROP_CTRL.PROP_DIR1
PROP_DIR2: R321.1 ; port PROP_CTRL.PROP_DIR2
PROP_EN: R319.1 ; port PROP_CTRL.PROP_EN
PROP_S1-Rx: R322.1 ; port PROP_CTRL.PROP_S1-Rx
PROP_S2-Tx: R320.2 ; port PROP_CTRL.PROP_S2-Tx
QEI_P1_A: R339.1 ; port QEI_PROP.QEI_P1_A
QEI_P1_B: R340.1 ; port QEI_PROP.QEI_P1_B
QEI_P2_A: R341.1 ; port QEI_PROP.QEI_P2_A
QEI_P2_B: R342.1 ; port QEI_PROP.QEI_P2_B
SPI1_MISO: J222.14 ; port SPI1.SPI1_MISO
SPI1_MOSI: J222.16 ; port SPI1.SPI1_MOSI
SPI1_SCK: J222.12 ; port SPI1.SPI1_SCK
SPI2_CS_1: R338.2 ; port SPI2.SPI2_CS_1
SPI2_MISO: R336.2 ; port SPI2.SPI2_MISO
SPI2_MOSI: R335.2 ; port SPI2.SPI2_MOSI
SPI2_SCK: R337.2 ; port SPI2.SPI2_SCK
STM_Rx: R403.2 ; port UART_STM.STM_Rx
STM_Tx: R401.1 ; port UART_STM.STM_Tx
SW_1: R295.2 ; port CLAVIER.SW_1
SW_2: R296.2 ; port CLAVIER.SW_2
SW_TIRETTE: R292.1 ; port CLAVIER.SW_TIRETTE
U5V: J222.7
VBAT: J221.34
VDD: J221.6
VIN: J221.23

Not connected (* = marked no-connect by the designer): J219 1* 3*; J220 2* 4*; J221 9* 25* 39* 40*; J222 39* 40*

### Buses and harness runs
bus CaptTOR_[1..12] = port CaptTOR_[1..12]
bus EXT_IO_[1..10] = port EXT_IO_[1..10]

### Layout directives
net class NUCLEO: +3V3, +5V, AVDD, BOOT0, E5V, GND, NRST, PA0, PA1, PA2, PA3, PA4, PA8, PA9, PA10, PA11, PA12, PA13, PA14, PA15, PB0, PB1, PB2, PB3, PB4, PB5, PB6, PB7, PB8, PB9, PB10, PB11, PB12, PB13, PB14, PB15, PC0, PC1, PC2, PC3, PC4, PC5, PC6, PC7, PC8, PC9, PC10, PC11, PC12, PC13, PC14, PC15, PD2, PD8, PF0, PF1, PF4, PF5, PF6, PF7, U5V, VBAT, VDD, VIN

### Notes on the sheet
- Nucleo F303RE
- SW_3
- Si E5V connecté à 5L
- alors déplacer JP5 sur la nucléo
- Si AVDD connecté à 3L_ADc
- alors enlever SB57 sur la nucléo
- Odrive_Tx
- Odrive_Rx
- (near J221) 1
- (near J221) CN7
- (near J221) 2
- (near J222) 1
- (near J222) CN10
- (near J222) 2
- (near R401) Reservé (STlink)
- (near R375) Reservé (STlink)
- NC
- (near J221) GND
- GND
- (near J222) PA5
- (near J222) PA6
- STM-I2C2
- (near R374) Si util:DNI SB17
- PA7
- (near J222) GND
- (near R358) Reservé (STlink)
- Reservé (Osc-STM)
- (near R374) Reservé (Osc-STM)
- Reservé (STlink)
- (near J221) 37
- (near J221) 38
- (near R305) Reservé (STlink)
- (near J222) 37
- (near J222) 38
- (near R304) NC
- Pin function, voir DS: STM32F303xE - table 13 - p41
- ToF_DS_1
- ToF_DS_2
- ToF_DS_3
- ToF_DS_4
- Routing note
- Warning note
- Function title
- Carte Mere - Nucleo
- Info note

### Library data of the parts
J219 J220 = 61000421821: WR-PHD Socket Header, SMT, pitch 2.54mm, Dual Row, Vertical, 4p; Manufacturer: Wurth Elektronik; Value: 4; ComponentLink1Description: Datasheet; ComponentLink1URL: https://www.we-online.com/catalog/datasheet/61000421821.pdf; Manufacturer Part Number: 61000421821; Supplier 1: Farnell; Supplier Part Number 1: 2827865
J221 J222 = 61004021821: WR-PHD Socket Header, SMT, pitch 2.54mm, Dual Row, Vertical, 40p; Manufacturer: Wurth Elektronik; Value: 40; ComponentLink1Description: Datasheet; ComponentLink1URL: https://www.we-online.com/catalog/datasheet/61004021821.pdf; Manufacturer Part Number: 61004021821; Supplier 1: Farnell; Supplier Part Number 1: 2827882
J223 = CAVALIER_0603_C: Cavalier soudure "fermé" + empreinte dipole 0603
R292-R296 R301-R306 R318-R322 R335-R342 R353-R359 R372-R376 R400-R403 = RC0402FR-0722RL: as R297 on sheet DE0_Nano; Type: Thick Film; ComponentLink1Description: Manufacturer; ComponentLink1URL: http://www.yageo.com/NewPortal/_en/index.jsp; ComponentLink2Description: Datasheet; ComponentLink2URL: http://www.farnell.com/datasheets/2167052.pdf; Manufacturer Part Number: RC0402FR-0722RL; Supplier 1: Farnell; Supplier Part Number 1: 9239030; Precision: ±1%; Supplier 2: JLCPCB; Supplier Part Number 2: C25092; Supplier Footprint 2: 0402

## Sheet Capteur.SchDoc
size A4; Author: Audran; CompanyName: Goldorak; Address1: Electrolab; Address2: 52 rue Paul Lescop; Address3: 92000 Nanterre; DocumentNumber: 5; SheetNumber: 5; SheetTotal: 8; ProjectName: Cartes_2017
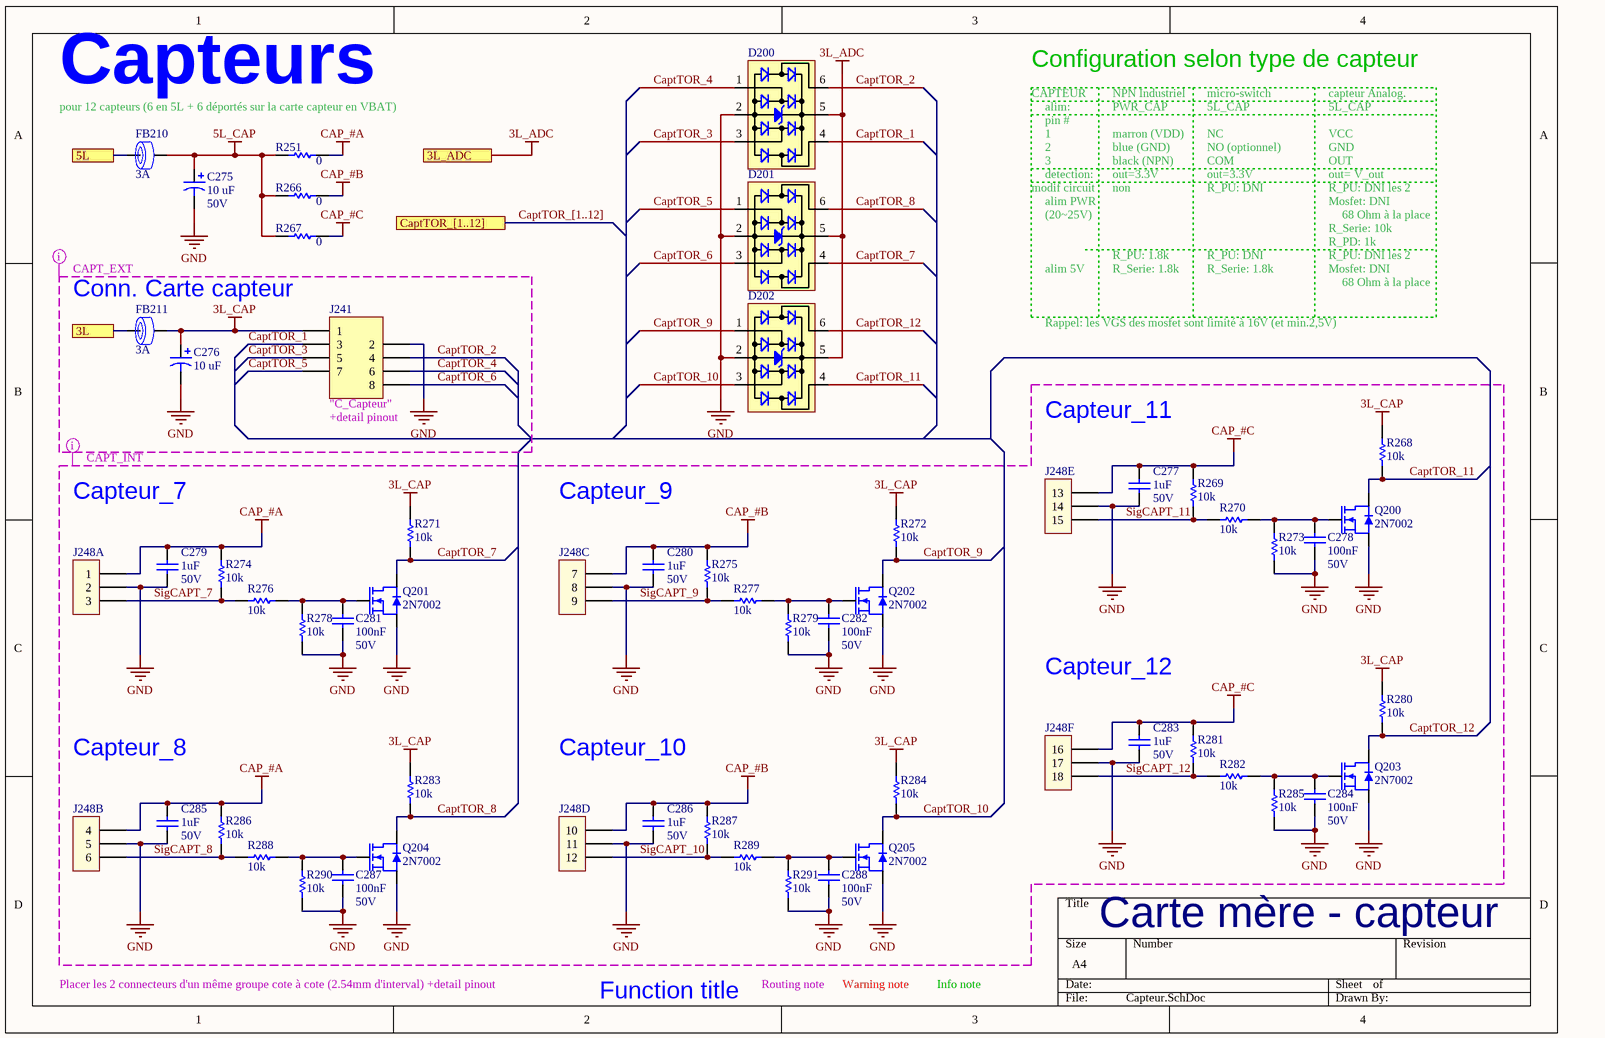
[diagram p3: Capteur.SchDoc]

### Parts
C275  10 uF  RatedVoltage: 50V  [WCAP-ATG8_5x11x2x0.5]
C276  10 uF  [WCAP-ATG8_5x11x2x0.5]
C277  1uF  RatedVoltage: 50V  [WCAP-CSGP_0805, 2x1.25x1.25]
C278  100nF  RatedVoltage: 50V  [WCAP-CSGP_0603, 1.6x0.8x0.8]
C279  1uF  RatedVoltage: 50V  [WCAP-CSGP_0805, 2x1.25x1.25]
C280  1uF  RatedVoltage: 50V  [WCAP-CSGP_0805, 2x1.25x1.25]
C281  100nF  RatedVoltage: 50V  [WCAP-CSGP_0603, 1.6x0.8x0.8]
C282  100nF  RatedVoltage: 50V  [WCAP-CSGP_0603, 1.6x0.8x0.8]
C283  1uF  RatedVoltage: 50V  [WCAP-CSGP_0805, 2x1.25x1.25]
C284  100nF  RatedVoltage: 50V  [WCAP-CSGP_0603, 1.6x0.8x0.8]
C285  1uF  RatedVoltage: 50V  [WCAP-CSGP_0805, 2x1.25x1.25]
C286  1uF  RatedVoltage: 50V  [WCAP-CSGP_0805, 2x1.25x1.25]
C287  100nF  RatedVoltage: 50V  [WCAP-CSGP_0603, 1.6x0.8x0.8]
C288  100nF  RatedVoltage: 50V  [WCAP-CSGP_0603, 1.6x0.8x0.8]
D200  824001  [SOT-23-6L]  (value not drawn)
D201  824001  [SOT-23-6L]  (value not drawn)
D202  824001  [SOT-23-6L]  (value not drawn)
FB210  RatedCurrent: 3A  [WE-CBF_0805_High Current]  (hidden comment: 742792023)
FB211  RatedCurrent: 3A  [WE-CBF_0805_High Current]  (hidden comment: 742792023)
J241  690367280876  [690367280876]  (value not drawn)
J248  TSW-106-08-F-T-RA  [TSW-106-08-F-T-RA]  (value not drawn)  (parts A,B,C,D,E,F of 6)
Q200  2N7002  [SOT-23]
Q201  2N7002  [SOT-23]
Q202  2N7002  [SOT-23]
Q203  2N7002  [SOT-23]
Q204  2N7002  [SOT-23]
Q205  2N7002  [SOT-23]
R251  value 0  [RESC1608X06N]  (hidden comment: RC0603FR-070RL)
R266  value 0  [RESC1608X06N]  (hidden comment: RC0603FR-070RL)
R267  value 0  [RESC1608X06N]  (hidden comment: RC0603FR-070RL)
R268  value 10k  [RESC1608X06N]  (hidden comment: RC0603FR-0710KL)
R269  value 10k  [RESC1608X06N]  (hidden comment: RC0603FR-0710KL)
R270  value 10k  [RESC1608X06N]  (hidden comment: RC0603FR-0710KL)
R271  value 10k  [RESC1608X06N]  (hidden comment: RC0603FR-0710KL)
R272  value 10k  [RESC1608X06N]  (hidden comment: RC0603FR-0710KL)
R273  value 10k  [RESC1608X06N]  (hidden comment: RC0603FR-0710KL)
R274  value 10k  [RESC1608X06N]  (hidden comment: RC0603FR-0710KL)
R275  value 10k  [RESC1608X06N]  (hidden comment: RC0603FR-0710KL)
R276  value 10k  [RESC1608X06N]  (hidden comment: RC0603FR-0710KL)
R277  value 10k  [RESC1608X06N]  (hidden comment: RC0603FR-0710KL)
R278  value 10k  [RESC1608X06N]  (hidden comment: RC0603FR-0710KL)
R279  value 10k  [RESC1608X06N]  (hidden comment: RC0603FR-0710KL)
R280  value 10k  [RESC1608X06N]  (hidden comment: RC0603FR-0710KL)
R281  value 10k  [RESC1608X06N]  (hidden comment: RC0603FR-0710KL)
R282  value 10k  [RESC1608X06N]  (hidden comment: RC0603FR-0710KL)
R283  value 10k  [RESC1608X06N]  (hidden comment: RC0603FR-0710KL)
R284  value 10k  [RESC1608X06N]  (hidden comment: RC0603FR-0710KL)
R285  value 10k  [RESC1608X06N]  (hidden comment: RC0603FR-0710KL)
R286  value 10k  [RESC1608X06N]  (hidden comment: RC0603FR-0710KL)
R287  value 10k  [RESC1608X06N]  (hidden comment: RC0603FR-0710KL)
R288  value 10k  [RESC1608X06N]  (hidden comment: RC0603FR-0710KL)
R289  value 10k  [RESC1608X06N]  (hidden comment: RC0603FR-0710KL)
R290  value 10k  [RESC1608X06N]  (hidden comment: RC0603FR-0710KL)
R291  value 10k  [RESC1608X06N]  (hidden comment: RC0603FR-0710KL)

### Ports
3L, 3L_ADC, 5L, CaptTOR_[1..12]

### Nets
3L: FB211.1 ; port 3L
3L_ADC: D200.5 D201.5 D202.5 ; port 3L_ADC
3L_CAP: C276.1 FB211.2 J241.1 R268.2 R271.2 R272.2 R280.2 R283.2 R284.2
5L: FB210.1 ; port 5L
5L_CAP: C275.1 FB210.2 R251.1 R266.1 R267.1
CAP_#A: C279.2 C285.2 J248.1 J248.4 R251.2 R274.2 R286.2
CAP_#B: C280.2 C286.2 J248.7 J248.10 R266.2 R275.2 R287.2
CAP_#C: C277.2 C283.2 J248.13 J248.16 R267.2 R269.2 R281.2
GND: C275.2 C276.2 C277.1 C278.2 C279.1 C280.1 C281.2 C282.2 C283.1 C284.2 C285.1 C286.1 C287.2 C288.2 D200.2 D201.2 D202.2 J241.2 J248.2 J248.5 J248.8 J248.11 J248.14 J248.17 Q200.2(S) Q201.2(S) Q202.2(S) Q203.2(S) Q204.2(S) Q205.2(S) R273.1 R278.1 R279.1 R285.1 R290.1 R291.1
CaptTOR_1: D200.4 J241.3
CaptTOR_2: D200.6 J241.4
CaptTOR_3: D200.3 J241.5
CaptTOR_4: D200.1 J241.6
CaptTOR_5: D201.1 J241.7
CaptTOR_6: D201.3 J241.8
CaptTOR_7: D201.4 Q201.3(D) R271.1
CaptTOR_8: D201.6 Q204.3(D) R283.1
CaptTOR_9: D202.1 Q202.3(D) R272.1
CaptTOR_10: D202.3 Q205.3(D) R284.1
CaptTOR_11: D202.4 Q200.3(D) R268.1
CaptTOR_12: D202.6 Q203.3(D) R280.1
SigCAPT_7: J248.3 R274.1 R276.1
SigCAPT_8: J248.6 R286.1 R288.1
SigCAPT_9: J248.9 R275.1 R277.1
SigCAPT_10: J248.12 R287.1 R289.1
SigCAPT_11: J248.15 R269.1 R270.1
SigCAPT_12: J248.18 R281.1 R282.1
NetC278_1: C278.1 Q200.1(G) R270.2 R273.2
NetC281_1: C281.1 Q201.1(G) R276.2 R278.2
NetC282_1: C282.1 Q202.1(G) R277.2 R279.2
NetC284_1: C284.1 Q203.1(G) R282.2 R285.2
NetC287_1: C287.1 Q204.1(G) R288.2 R290.2
NetC288_1: C288.1 Q205.1(G) R289.2 R291.2

### Buses and harness runs
bus CaptTOR_[1..12] = port CaptTOR_[1..12]

### Layout directives
net class CAPT_INT: 3L_CAP, CAP_#A, CAP_#B, CAP_#C, CaptTOR_7, CaptTOR_8, CaptTOR_9, CaptTOR_10, CaptTOR_11, CaptTOR_12, GND, SigCAPT_7, SigCAPT_8, SigCAPT_9, SigCAPT_10, SigCAPT_11, SigCAPT_12
net class CAPT_EXT: 3L_CAP, CaptTOR_1, CaptTOR_2, CaptTOR_3, CaptTOR_4, CaptTOR_5, CaptTOR_6, GND

### Notes on the sheet
- pour 12 capteurs (6 en 5L + 6 déportés sur la carte capteur en VBAT)
- Capteurs
- CAPTEUR
- Configuration selon type de capteur
- alim:
- NPN Industriel
- PWR_CAP
- micro-switch
- 5L_CAP
- capteur Analog.
- pin #
- 1
- 2
- 3
- detection:
- marron (VDD)
- blue (GND)
- black (NPN)
- out=3.3V
- NC
- NO (optionnel)
- COM
- VCC
- OUT
- GND
- out= V_out
- modif circuit
- alim PWR
- (20~25V)
- non
- R_PU: DNI
- R_PU: DNI les 2
- Mosfet: DNI
- R_Serie: 10k
- R_PD: 1k
- 68 Ohm à la place
- Conn. Carte capteur
- alim 5V
- R_PU: 1.8k
- R_Serie: 1.8k
- Rappel: les VGS des mosfet sont limité à 16V (et min.2,5V)
- (near J241) "C_Capteur"
- (near J241) +detail pinout
- Capteur_11
- Capteur_7
- Capteur_9
- Capteur_12
- Capteur_8
- Capteur_10
- Placer les 2 connecteurs d'un même groupe cote à cote (2.54mm d'interval) +detail pinout
- Routing note
- Warning note
- Info note
- Carte mère - capteur
- Function title

### Library data of the parts
C275 = WCAP-ATG8, 860010672009: CAP Alu 10 UF 20% 50 V; Manufacturer: Wurth Elektronik; ComponentLink1Description: Datasheet; ComponentLink1URL: http://katalog.we-online.de/pbs/datasheet/860010672009.pdf; Value: 10 uF; Size: 5mmx11mm; Manufacturer Part Number: 860010672009
C276 = WCAP-ATG8, 860010672009: CAP Alu 10 UF 20% 50 V; Manufacturer: Wurth Elektronik; RatedVoltage: 50V; ComponentLink1Description: Datasheet; ComponentLink1URL: http://katalog.we-online.de/pbs/datasheet/860010672009.pdf; Value: 10 uF; Size: 5mmx11mm; Manufacturer Part Number: 860010672009
C277 C279 C280 C283 C285 C286 = WCAP-CSGP, 885012207103: CAP CER 1uF 50V X7R 0805; Manufacturer: Wurth Elektronik; ComponentLink1Description: Datasheet; ComponentLink1URL: http://katalog.we-online.com/pbs/datasheet/885012207103.pdf; Manufacturer Part Number: 885012207103; Value: 1uF; Size: 0805; CeramicType: X7R; Supplier 2: JLCPCB; Supplier Part Number 2: C28323; Supplier Footprint 2: 0805
C278 C281 C282 C284 C287 C288 = WCAP-CSGP, 885012206095: CAP CER 100nF 50V X7R 0603; Manufacturer: Wurth Elektronik; ComponentLink1Description: Datasheet; ComponentLink1URL: http://katalog.we-online.com/pbs/datasheet/885012206095.pdf; Value: 100nF; Size: 0603; CeramicType: X7R; Manufacturer Part Number: 885012206095; Supplier 2: JLCPCB; Supplier Part Number 2: C14663; Supplier Footprint 2: 0603
D200-D202 = 824001: WE-TVS TVS Diode 4+1Ch 5V SOT23-6L; Manufacturer: Wurth Elektronik; ComponentLink1Description: Datasheet; ComponentLink1URL: https://www.we-online.com/catalog/datasheet/824001.pdf; Manufacturer Part Number: 824001; Supplier 1: Farnell; Supplier Part Number 1: 1748613; Type: TVS; Value: 5V; Supplier 2: JLCPCB; Supplier Part Number 2: C85364; Supplier Footprint 2: SOT-23-6L
FB210 FB211 = WE-CBF, 742792023: as FB200 on sheet DE0_Nano; ComponentLink1Description: Manufacturer; ComponentLink1URL: https://www.we-online.com/catalog/en/WE-CBF/?sq=742792023#742792023; ComponentLink2Description: Datasheet; ComponentLink2URL: https://www.we-online.com/catalog/datasheet/742792023.pdf; Manufacturer Part Number: 742792023; Supplier 2: JLCPCB; Supplier Part Number 2: C1015; Supplier 1: Farnell; Supplier Part Number 1: 1635732; Supplier Footprint 2: 0805
J241 = 690367280876: WR-MM 8p Female SMT Connector with Polarization; Manufacturer: Wurth Electronics Inc.; Value: 8; Manufacturer Part Number: 690367280876; ComponentLink1Description: Datasheet; ComponentLink1URL: http://katalog.we-online.de/em/datasheet/69036728xx76.pdf; Supplier 1: Farnell; Supplier Part Number 1: 1641850
J248 = TSW-106-08-F-T-RA: CONN HEADER R/A 3L x 6POS 2.54MM; Manufacturer: SAMTEC; Manufacturer Part Number: TSW-106-08-F-T-RA; ComponentLink1Description: Datasheet; ComponentLink1URL: http://cloud.samtec.com/catalog_english/TSW_TH.PDF; Supplier 1: Farnell; Supplier Part Number 1: 2053043
Q200-Q205 = 2N7002: MOSFET N 60V 115MA SOT23; Manufacturer: Changjiang Electronics Tech (CJ); Supplier 1: Farnell; Supplier Part Number 1: 1510761; Manufacturer Part Number: 2N7002; ComponentLink1Description: Datasheet; ComponentLink1URL: https://datasheet.lcsc.com/szlcsc/1810151612_Changjiang-Electronics-Tech-CJ-2N7002_C8545.pdf; Supplier 2: JLCPCB; Supplier Part Number 2: C8545; Supplier Footprint 2: SOT-23-3
R251 R266 R267 = RC0603FR-070RL: RES SMD 0 OHM 1% 1/10W 0603; Manufacturer: Yageo; Power: 100mW; Vmax: 50V; Manufacturer Part Number: RC0603FR-070RL; Type: Thick Film; ComponentLink1Description: Manufacturer; ComponentLink1URL: http://www.yageo.com/NewPortal/_en/index.jsp; ComponentLink2Description: Datasheet; ComponentLink2URL: http://www.farnell.com/datasheets/2167052.pdf; Supplier 1: Farnell; Precision: ±1%; Supplier Part Number 1: 2309106; Supplier 2: JLCPCB; Supplier Part Number 2: C21189; Supplier Footprint 2: 0603
R268-R291 = RC0603FR-0710KL: RES SMD 10K OHM 1% 1/10W 0603; Manufacturer: Yageo; Power: 100mW; Vmax: 50V; Manufacturer Part Number: RC0603FR-0710KL; Type: Thick Film; ComponentLink1Description: Manufacturer; ComponentLink1URL: http://www.yageo.com/NewPortal/_en/index.jsp; ComponentLink2Description: Datasheet; ComponentLink2URL: http://www.farnell.com/datasheets/2167052.pdf; Supplier 1: Farnell; Supplier Part Number 1: 9238603; Precision: ±1%; Supplier 2: JLCPCB; Supplier Part Number 2: C25804; Supplier Footprint 2: 0603